# Altium schematic sheet pca63519 - Power.SchDoc: PCA63519 - Smart Remote 3 DK shield - Power
size A4; DocumentNumber: 2; Revision: 1.2.1; SheetNumber: 2; SheetTotal: 6; DrawnBy: GETR; ProjectNumber: 4414; DocumentSize: A4; PCBRevision: 0049GETR; PCAName: PCA63519; PCBNumber: 400129
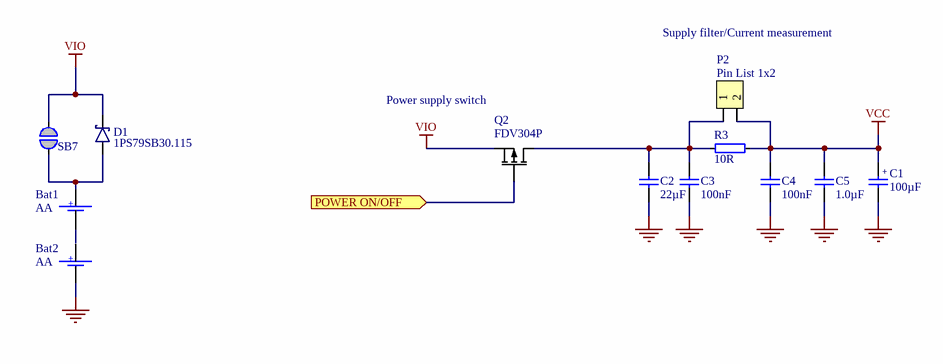
[diagram p0: pca63519 - Power.SchDoc]

## Parts
Bat1  AA  [POLSATBATTERYHOLDER]
Bat2  AA  [POLSATBATTERYHOLDER]
C1  100µF  [CAPMP3528X21N]
C2  22µF  [CAPC2012X11L]
C3  100nF  [CAPC1005X04L]
C4  100nF  [CAPC1005X04L]
C5  1.0µF  [CAPC1005X04L]
D1  1PS79SB30.115  [SOD-523]
P2  Pin List 1x2  [LIST_1x2]
Q2  FDV304P  [SOT-23a]
R3  10R  [RESC1005X04L]
SB7  Solderbridge  [Solderbridge_0.4]  (value not drawn)  (no BOM)

## Ports
POWER ON/OFF (in)

## Nets
GND: Bat2.1 C1.2 C2.1 C3.1 C4.1 C5.1
VCC: C1.1 C4.2 C5.2 P2.2 R3.2
VIO: D1.3(C) Q2.2(S) SB7.1
POWER ON/OFF: Q2.1(G) ; port POWER ON/OFF
NetBat1_1: Bat1.1 D1.1(A) SB7.2
NetC2_2: C2.2 C3.2 P2.1 Q2.3(D) R3.1

## Notes on the sheet
- Supply filter/Current measurement
- (near Q2) Power supply switch
- Title
- Size
- Date:
- Project Number
- Sheet         of
- Revision
- File:
- Drawn By:
- (in symbol C3528-100µF) +
- (in symbol POLSATBATTERYHOLDER_N) +
- (in symbol POLSATBATTERYHOLDER_P) +

## Library data of the parts
Bat1 = POLSATBATTERYHOLDER_P: Polsat Battery holder, Positive pole; Manufacturer Part Number: NA; Artikkelnr Noca: N.A.; Part Number: POLSATBATTERYHOLDER_P; Manufacturer: PolSat; Datasheet: NA; Footprint Doc: POLSATBATTERYHOLDER; LatestRevisionDate: 2015-09-24; Pin Count: 1; Publisher: Nordic Semiconductor; Published: 2015-09-24; Value: POLSATBATTERYHOLDER; Note: AA; Supplier: *; Supplier part number: *; 2nd source Supplier: *; 2nd source part number: *; Artikkelnr Simpro: N.A.
Bat2 = POLSATBATTERYHOLDER_N: Polsat Battery holder, Negative pole; Manufacturer Part Number: NA; Artikkelnr Noca: N.A.; Part Number: POLSATBATTERYHOLDER_N; Manufacturer: PolSat; Datasheet: NA; Footprint Doc: POLSATBATTERYHOLDER; LatestRevisionDate: 2015-09-24; Pin Count: 1; Publisher: Nordic Semiconductor; Published: 2015-09-24; Value: POLSATBATTERYHOLDER; Note: AA; Supplier: *; Supplier part number: *; 2nd source Supplier: *; 2nd source part number: *; Artikkelnr Simpro: N.A.
C1 = C3528-100µF: Capacitor, Tantalum, ±10%; Manufacturer: Vishay Sprague; Manufacturer Part Number: TR3B107K6R3C0500; Note: 6.3V; Artikkelnr Noca: N.A.; Part Number: C3528-100µF; Datasheet: http://www.farnell.com/datasheets/438325.pdf; Footprint Doc: 3528; LatestRevisionDate: 2013-06-05; Pin Count: 2; Publisher: Nordic Semiconductor; Published: 2010-10-26; Value: 100µF; Supplier: Farnell; Supplier part number: 175-4047; 2nd source Supplier: *; 2nd source part number: *; Artikkelnr Simpro: N.A.
C2 = C0805-22µ: Capacitor, X5R, ±10%; Note: 6.3V; Artikkelnr Noca: 20039330; Artikkelnr Simpro: N.A.; Part Number: C0805-22µ; Manufacturer: *; Manufacturer Part Number: *; Datasheet: *; Footprint Doc: 0805; LatestRevisionDate: 2013-06-04; Pin Count: 2; Publisher: Nordic Semiconductor; Published: 2011-01-17; Value: 22µF; Supplier: *; Supplier part number: *; 2nd source Supplier: *; 2nd source part number: *
C3 C4 = C0402-100n: Capacitor, X7R, ±10%; Note: 16V; Artikkelnr Noca: 20039200; Artikkelnr Simpro: N.A.; Part Number: C0402-100n; Manufacturer: *; Manufacturer Part Number: *; Datasheet: *; Footprint Doc: 0402; LatestRevisionDate: 2009-11-23; Pin Count: 2; Publisher: Nordic Semiconductor; Published: 2009-05-08; Value: 100nF; Supplier: *; Supplier part number: *; 2nd source Supplier: *; 2nd source part number: *
C5 = C0402-1µ0: Capacitor, X5R, ±5%; Note: 6.3V; Artikkelnr Noca: 20039235; Artikkelnr Simpro: N.A.; Part Number: C0402-1µ0; Manufacturer: *; Manufacturer Part Number: *; Datasheet: *; Footprint Doc: 0402; LatestRevisionDate: 2016-08-22; Pin Count: 2; Publisher: Nordic Semiconductor; Published: 2009-05-08; Value: 1.0µF; Supplier: Digi-Key; Supplier part number: 1276-1444-1-ND; 2nd source Supplier: *; 2nd source part number: *
D1 = 1PS79SB30.115: Diode Schottky Vf=0.38, Vr=40V, If=200mA, Ir=500nA; Manufacturer: NXP; 2nd source part number: 873-4097; Artikkelnr Noca: 10029120; Artikkelnr Simpro: N.A.; Part Number: 1PS79SB30.115; Manufacturer Part Number: 1PS79SB30.115; Datasheet: http://www.nxp.com/documents/data_sheet/1PS79SB30.pdf; Footprint Doc: SOD-523; LatestRevisionDate: 2016-08-26; Pin Count: 2; Publisher: Nordic Semiconductor; Published: 2014-09-24; Value: 1PS79SB30.115; Note: *; Supplier: Digi-Key; Supplier part number: 568-5973-1-ND; 2nd source Supplier: Farnell
P2 = Pin List 1x2: Pin List 1x2, 2.54mm (100mil); Artikkelnr Noca: 56019040; Artikkelnr Simpro: N.A.; Part Number: Pin List 1x2; Manufacturer: *; Manufacturer Part Number: *; Datasheet: *; Footprint Doc: LIST_1x2; LatestRevisionDate: 2009-12-12; Pin Count: 2; Publisher: Nordic Semiconductor; Published: 2009-12-12; Value: Pin List 1x2; Note: *; Supplier: *; Supplier part number: *; 2nd source Supplier: *; 2nd source part number: *
Q2 = FDV304P: Mosfet FDV304P; 2nd source part number: FDV304PCT-ND; Note: Schottky; Artikkelnr Noca: 35029046; Artikkelnr Simpro: N.A.; Part Number: FDV304P; Manufacturer: *; Manufacturer Part Number: *; Datasheet: *; Footprint Doc: SOT-23a; LatestRevisionDate: 2009-11-23; Pin Count: 3; Publisher: Nordic Semiconductor; Published: 2009-05-11; Value: FDV304P; Supplier: Farnell; Supplier part number: 984-6123; 2nd source Supplier: Digi-Key
R3 = R0402-10R: Resistor, ±1%, 0.063W; Note: Chip Res 1%; Artikkelnr Noca: 27049025; Artikkelnr Simpro: N.A.; Value Ohm: 10; Part Number: R0402-10R; Manufacturer: *; Manufacturer Part Number: *; Datasheet: *; Footprint Doc: 0402; LatestRevisionDate: 2009-11-23; Pin Count: 2; Publisher: Nordic Semiconductor; Published: 2009-05-08; Value: 10R; Supplier: Farnell; Supplier part number: 173-8824; 2nd source Supplier: *; 2nd source part number: *
SB7 = Solderbridge 0.4mm: Artikkelnr Noca: N.A.; Part Number: Solderbridge 0.4mm; Manufacturer: *; Manufacturer Part Number: *; Datasheet: *; Footprint Doc: Solderbridge; LatestRevisionDate: 2009-12-14; Pin Count: 2; Publisher: Nordic Semiconductor; Published: 2009-12-14; Value: Solderbridge; Note: *; Supplier: *; Supplier part number: *; 2nd source Supplier: *; 2nd source part number: *; Artikkelnr Simpro: N.A.